# Altium project ESC30A.PrjPcb (part 1 of 3)
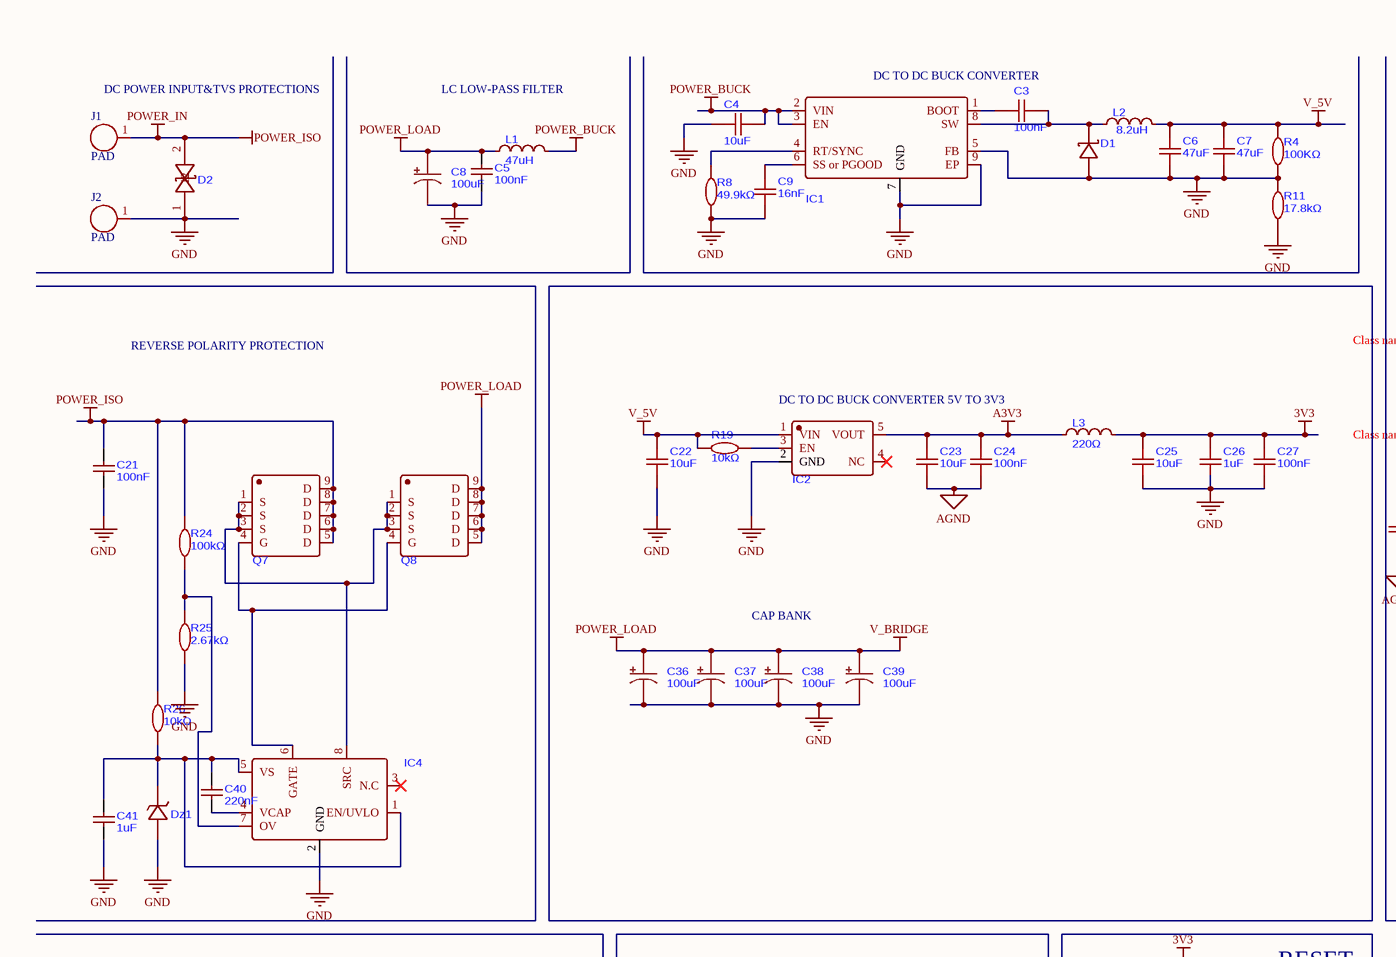
[diagram p0: ESC.SchDoc, top left]
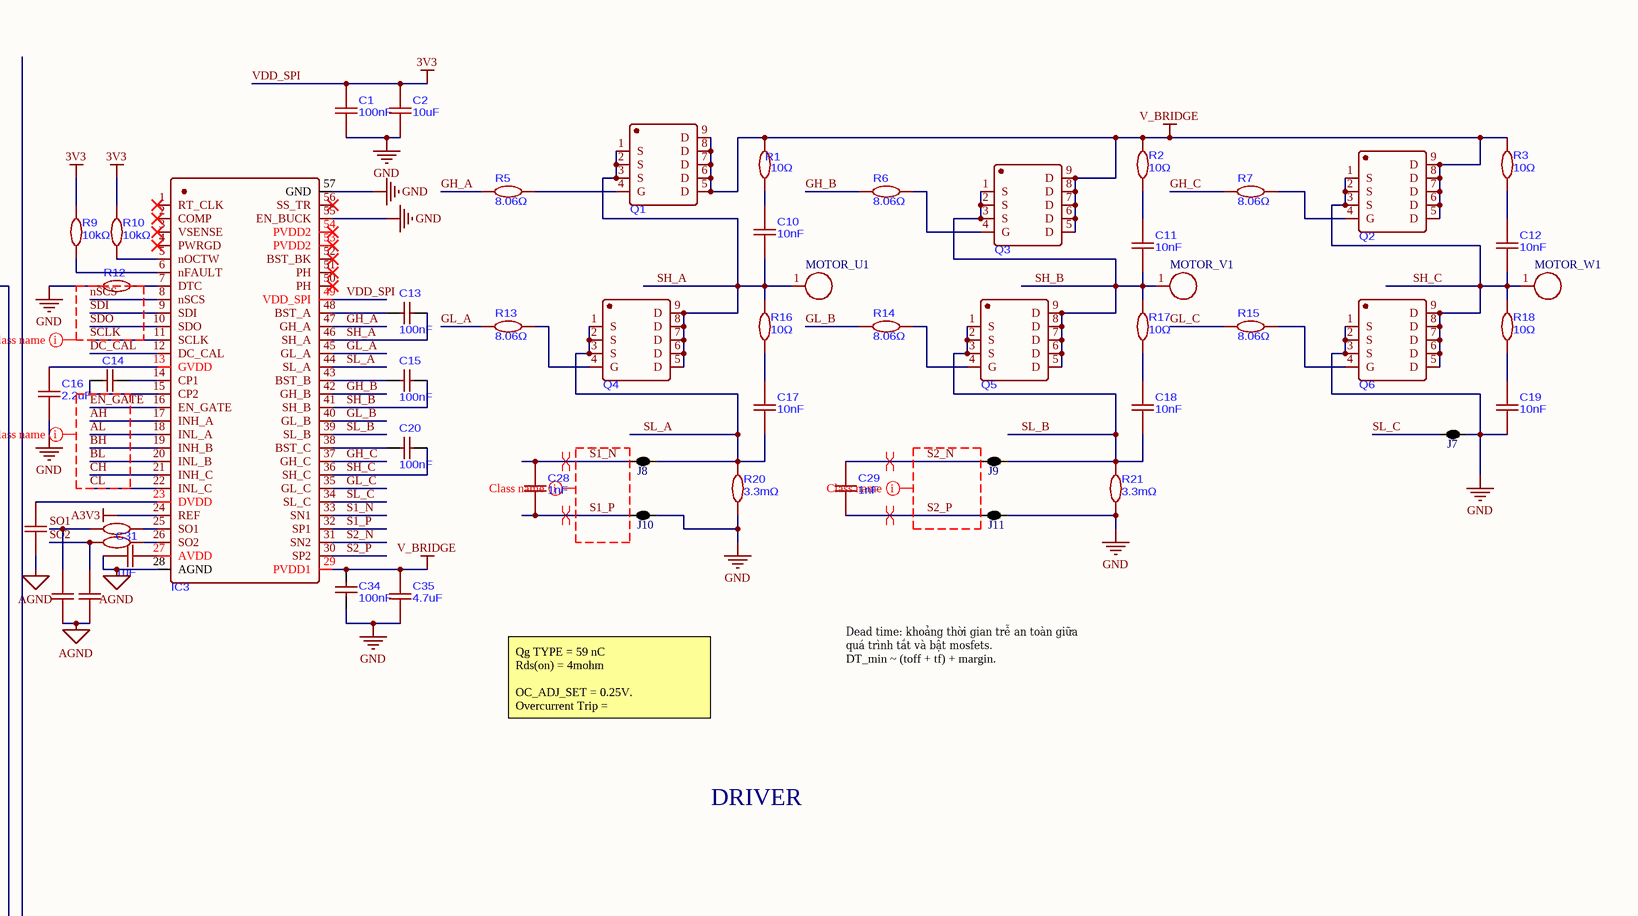
[diagram p1: ESC.SchDoc, top right]
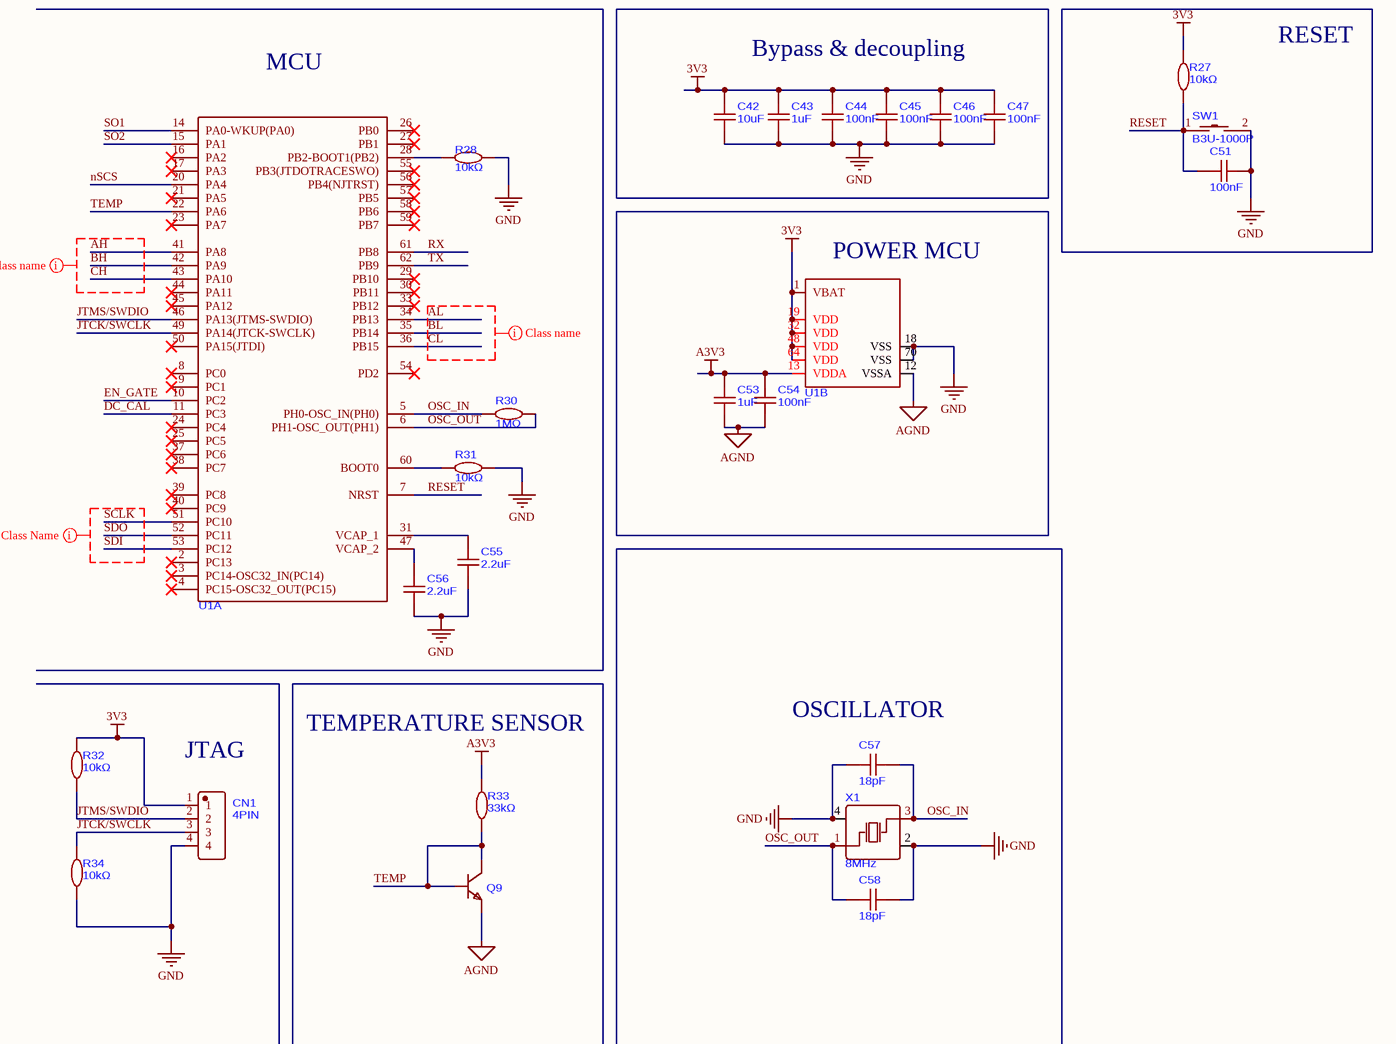
[diagram p2: ESC.SchDoc, bottom left]
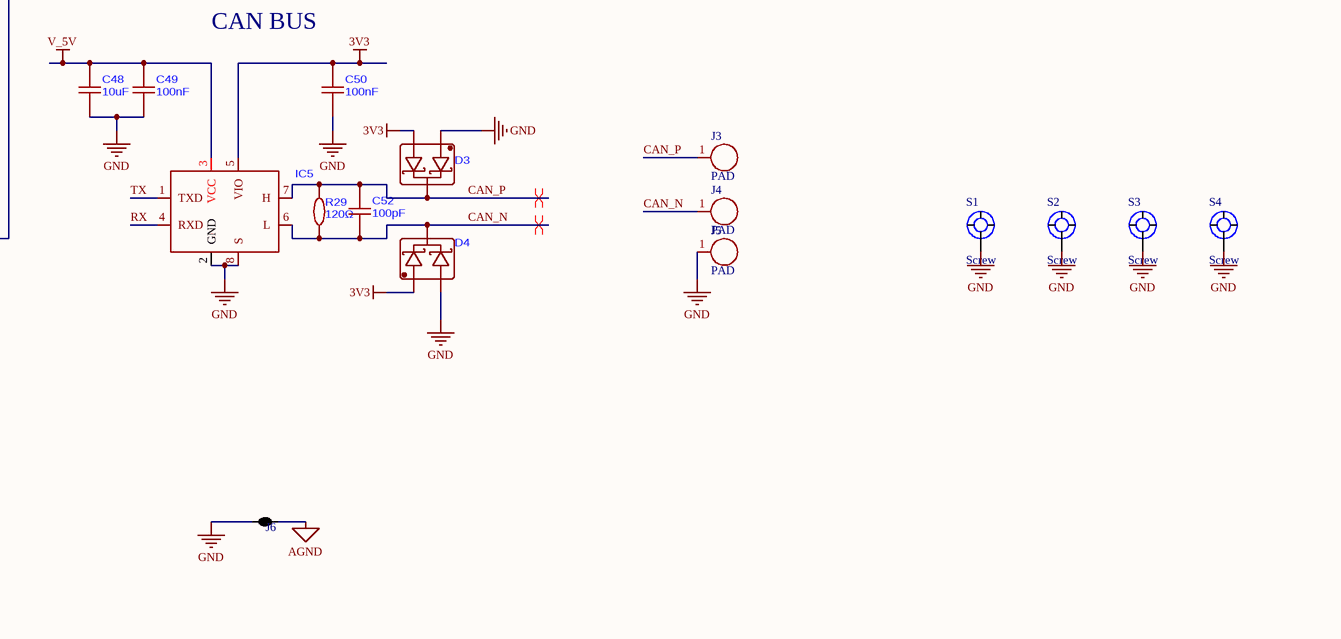
[diagram p3: ESC.SchDoc, bottom right]
1 sheet, 136 parts. Net scope: global (net labels, ports and power ports of the same name join across sheets).
Board file: ESC.PcbDoc
## Sheet ESC.SchDoc